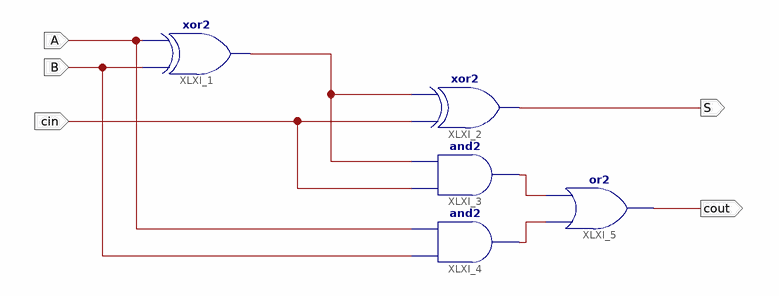
[diagram p0: schematic sheet 1]
// Xilinx ISE schematic fulladder.sch (spartan3e) as structural Verilog: 5 symbols, 5 ports
module fulladder (
  input  A,
  input  B,
  input  cin,
  output cout,
  output S
);

  wire XLXN_12, XLXN_13, XLXN_14;

  xor XLXI_1 (XLXN_14, B, A);
  xor XLXI_2 (S, cin, XLXN_14);
  and XLXI_3 (XLXN_12, cin, XLXN_14);
  and XLXI_4 (XLXN_13, B, A);
  or XLXI_5 (cout, XLXN_13, XLXN_12);
endmodule
